# Altium project mb1260.PrjPCB (part 3 of 3)
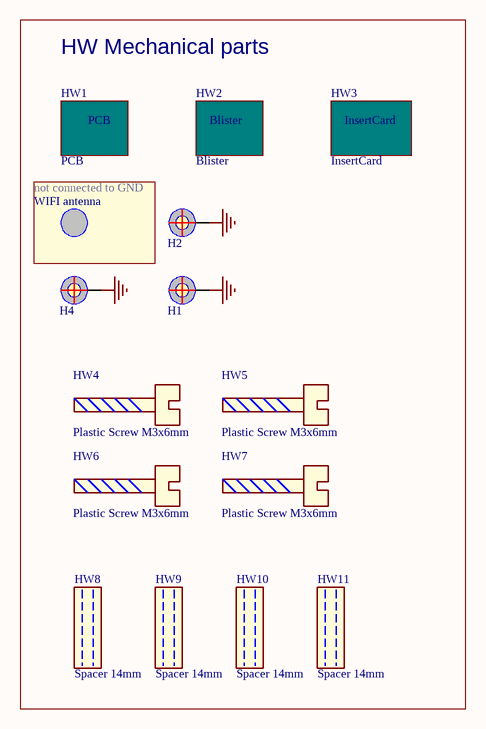
[diagram p13: HW_Mechanical_Parts.SchDoc]

## Nets that join several sheets
1V8: ST_LINK_V2-1 (C57.2 U9.2 U9.4), AUDIO (6 pins)
3V3: ST_LINK_V2-1 (C15.2 C16.2 U4.4 U9.3), AUDIO (11 pins), Peripherals (13 pins), ARDUINO (CN12.2 CN12.4), PSRAM (6 pins), USB_OTG_FS (R73.2 R79.2 R83.2 R84.2), STM32F7 (14 pins), LCD_FRIDA (6 pins), USB_OTG_HS (R80.1 R81.1 R82.2), QSPI (C13.2 R30.2 U5.8 U6.8)
5V: ST_LINK_V2-1 (11 pins), Peripherals (P1.6 P1.15), ARDUINO (CN12.5), USB_OTG_FS (U14.5), LCD_FRIDA (L3.1), USB_OTG_HS (U13.5)
5V_USB_FS: ST_LINK_V2-1 (CN8.7 D3.1), USB_OTG_FS (R99.2)
5V_USB_HS: ST_LINK_V2-1 (CN8.3 D5.1), USB_OTG_HS (6 pins)
E5V: ST_LINK_V2-1 (6 pins), ARDUINO (R58.2)
GND: ST_LINK_V2-1 (55 pins), AUDIO (41 pins), Peripherals (15 pins), ARDUINO (5 pins), PSRAM (5 pins), USB_OTG_FS (13 pins), STM32F7 (70 pins), LCD_FRIDA (12 pins), USB_OTG_HS (13 pins), QSPI (C13.1 U5.4 U6.4), HW_Mechanical_Parts (H1.1 H2.1 H4.1)
VDD: STM32F7 (34 pins), LCD_FRIDA (CN17.25 R68.1 R70.1 SB15.1)
VIN: ST_LINK_V2-1 (C74.2 U11.3), ARDUINO (CN12.8)
VREF+: ARDUINO (C50.2 R53.2), STM32F7 (C59.2 C64.1 R62.1 U8.P1)
ARD_A0: ARDUINO (CN15.1), STM32F7 (U8.P3)
ARD_A1: ARDUINO (CN15.2), STM32F7 (U8.N4)
ARD_A2: ARDUINO (CN15.3), STM32F7 (U8.N5)
ARD_A3: ARDUINO (CN15.4), STM32F7 (U8.L1)
ARD_A4: ARDUINO (SB35.1), STM32F7 (U8.M2)
ARD_A5: ARDUINO (SB37.1), STM32F7 (U8.M3)
ARD_D0: ARDUINO (CN13.1), STM32F7 (U8.R2)
ARD_D1: ARDUINO (CN13.2), STM32F7 (U8.P2)
ARD_D2: ARDUINO (CN13.3), STM32F7 (U8.P5)
ARD_D3: ARDUINO (CN13.4), STM32F7 (U8.B2)
ARD_D4: ARDUINO (CN13.5), STM32F7 (U8.G4)
ARD_D5: ARDUINO (CN13.6), STM32F7 (U8.R5)
ARD_D6: ARDUINO (CN13.7), STM32F7 (U8.B3)
ARD_D7: ARDUINO (CN13.8), STM32F7 (U8.A1)
ARD_D8: ARDUINO (CN11.1), STM32F7 (U8.B1)
ARD_D9: ARDUINO (CN11.2), STM32F7 (U8.M11)
ARD_D10: ARDUINO (CN11.3), STM32F7 (U8.N2)
ARD_D11: ARDUINO (CN11.4), STM32F7 (U8.A6)
ARD_D12: ARDUINO (CN11.5), STM32F7 (U8.A9)
ARD_D13: ARDUINO (CN11.6 SB14.2), STM32F7 (U8.P4)
ARD_D14: ARDUINO (CN11.9 SB36.1), STM32F7 (R59.1 U8.J4)
ARD_D15: ARDUINO (CN11.10 SB38.1), STM32F7 (R60.1 U8.H4)
CTP_INT: STM32F7 (U8.D3), LCD_FRIDA (CN16.2 R21.2)
CTP_RST: STM32F7 (U8.M13), LCD_FRIDA (CN16.7 R18.2)
CTP_SCL: STM32F7 (R52.2 U8.F15), LCD_FRIDA (CN16.5)
CTP_SDA: STM32F7 (R56.1 U8.M12), LCD_FRIDA (CN16.4)
LCD-RS_A0: STM32F7 (R101.2), LCD_FRIDA (CN17.21)
LCD_BL: STM32F7 (U8.L12), LCD_FRIDA (L7.1)
LCD_NE: STM32F7 (U8.C10), LCD_FRIDA (CN17.22 R70.2)
LCD_PSRAM_D0: PSRAM (U10.B6), STM32F7 (U8.M14), LCD_FRIDA (CN17.18)
LCD_PSRAM_D1: PSRAM (U10.C5), STM32F7 (U8.L14), LCD_FRIDA (CN17.17)
LCD_PSRAM_D2: PSRAM (U10.C6), STM32F7 (U8.B12), LCD_FRIDA (CN17.16)
LCD_PSRAM_D3: PSRAM (U10.D5), STM32F7 (U8.C12), LCD_FRIDA (CN17.15)
LCD_PSRAM_D4: PSRAM (U10.E5), STM32F7 (U8.R8), LCD_FRIDA (CN17.14)
LCD_PSRAM_D5: PSRAM (U10.F5), STM32F7 (U8.P8), LCD_FRIDA (CN17.13)
LCD_PSRAM_D6: PSRAM (U10.F6), STM32F7 (U8.P9), LCD_FRIDA (CN17.12)
LCD_PSRAM_D7: PSRAM (U10.G6), STM32F7 (U8.R9), LCD_FRIDA (CN17.11)
LCD_PSRAM_D8: PSRAM (U10.B1), STM32F7 (U8.P10), LCD_FRIDA (CN17.10)
LCD_PSRAM_D9: PSRAM (U10.C1), STM32F7 (U8.R10), LCD_FRIDA (CN17.9)
LCD_PSRAM_D10: PSRAM (U10.C2), STM32F7 (U8.N11), LCD_FRIDA (CN17.8)
LCD_PSRAM_D11: PSRAM (U10.D2), STM32F7 (U8.P11), LCD_FRIDA (CN17.7)
LCD_PSRAM_D12: PSRAM (U10.E2), STM32F7 (U8.R11), LCD_FRIDA (CN17.6)
LCD_PSRAM_D13: PSRAM (U10.F2), STM32F7 (U8.P15), LCD_FRIDA (CN17.5)
LCD_PSRAM_D14: PSRAM (U10.F1), STM32F7 (U8.P14), LCD_FRIDA (CN17.4)
LCD_PSRAM_D15: PSRAM (U10.G1), STM32F7 (U8.N15), LCD_FRIDA (CN17.3)
LCD_PSRAM_NOE: PSRAM (U10.A2), STM32F7 (U8.D10), LCD_FRIDA (CN17.19)
LCD_PSRAM_NWE: PSRAM (R64.1), STM32F7 (U8.C11), LCD_FRIDA (CN17.20)
LCD_RST: STM32F7 (U8.N12), LCD_FRIDA (CN17.23 R68.2)
LCD_TE_INT: STM32F7 (U8.G14), LCD_FRIDA (CN17.2)
NRST: ST_LINK_V2-1 (R28.2 SB10.2), Peripherals (SB34.1), ARDUINO (CN12.3), STM32F7 (C93.2 R57.1 U8.J1)
PMOD_GPIO_0: Peripherals (P2.9), STM32F7 (U8.B8)
PMOD_GPIO_1: Peripherals (P2.10), STM32F7 (U8.F4)
PMOD_INT: Peripherals (P1.11 P2.7), STM32F7 (U8.R13)
PMOD_RESET: Peripherals (P1.12 P2.8), STM32F7 (U8.R6)
PMOD_SEL_0: Peripherals (R102.1 U20.3), STM32F7 (U8.D13)
PMOD_SEL_1: Peripherals (R29.2 U20.10), STM32F7 (U8.E3)
PMOD_SPI2_MISO: Peripherals (U20.6), STM32F7 (U8.C14)
PMOD_SPI2_MOSI: Peripherals (U20.1), STM32F7 (U8.C13)
PMOD_SPI2_NSS: Peripherals (U20.9), STM32F7 (U8.E14)
PMOD_SPI2_SCK: Peripherals (U20.14), STM32F7 (U8.D14)
PMOD_UART7_CTS: Peripherals (U20.7), STM32F7 (U8.L2)
PMOD_UART7_RTS: Peripherals (U20.12), STM32F7 (U8.L3)
PMOD_UART7_RXD: Peripherals (U20.4), STM32F7 (U8.K2)
PMOD_UART7_TXD: Peripherals (U20.15), STM32F7 (U8.K1)
PSRAM_A0: PSRAM (U10.A3), STM32F7 (R101.1 U8.E2)
PSRAM_A1: PSRAM (U10.A4), STM32F7 (U8.H3)
PSRAM_A2: PSRAM (U10.A5), STM32F7 (U8.H2)
PSRAM_A3: PSRAM (U10.B3), STM32F7 (U8.J2)
PSRAM_A4: PSRAM (U10.B4), STM32F7 (U8.J3)
PSRAM_A5: PSRAM (U10.C3), STM32F7 (U8.K3)
PSRAM_A6: PSRAM (U10.C4), STM32F7 (U8.P6)
PSRAM_A7: PSRAM (U10.D4), STM32F7 (U8.N6)
PSRAM_A8: PSRAM (U10.H2), STM32F7 (U8.R7)
PSRAM_A9: PSRAM (U10.H3), STM32F7 (U8.P7)
PSRAM_A10: PSRAM (U10.H4), STM32F7 (U8.N7)
PSRAM_A11: PSRAM (U10.H5), STM32F7 (U8.M7)
PSRAM_A12: PSRAM (U10.G3), STM32F7 (U8.L15)
PSRAM_A13: PSRAM (U10.G4), STM32F7 (U8.K15)
PSRAM_A14: PSRAM (U10.F3), STM32F7 (U8.K14)
PSRAM_A15: PSRAM (U10.F4), STM32F7 (U8.K13)
PSRAM_A16: PSRAM (U10.E4), STM32F7 (U8.N14)
PSRAM_A17: PSRAM (U10.D3), STM32F7 (U8.N13)
PSRAM_NBL0: PSRAM (U10.A1), STM32F7 (U8.A4)
PSRAM_NBL1: PSRAM (U10.B2), STM32F7 (U8.A3)
PSRAM_NE1: PSRAM (R65.1), STM32F7 (U8.A11)
QSPI_CLK: STM32F7 (U8.M6), QSPI (U5.6 U6.6)
QSPI_D0: STM32F7 (U8.F14), QSPI (U5.5 U6.5)
QSPI_D1: STM32F7 (U8.B14), QSPI (U5.2 U6.2)
QSPI_D2: STM32F7 (U8.A2), QSPI (U5.3 U6.3)
QSPI_D3: STM32F7 (U8.M15), QSPI (U5.7 U6.7)
QSPI_NCS: STM32F7 (U8.B6), QSPI (R30.1 U5.1 U6.1)
SAI2_FS_A: AUDIO (U7.E3), STM32F7 (TP11.1 U8.C2)
SAI2_I2C1_SCL: AUDIO (R39.1), STM32F7 (R44.2 U8.A5)
SAI2_I2C1_SDA: AUDIO (R35.1), STM32F7 (R42.2 U8.B4)
SAI2_INT: AUDIO (U7.G3), STM32F7 (U8.B7)
SAI2_MCLK_A: AUDIO (U7.D3), STM32F7 (TP6.1 U8.D4)
SAI2_SCK_A: AUDIO (U7.G1), STM32F7 (TP7.1 U8.C4)
SAI2_SD_A: AUDIO (U7.E4), STM32F7 (TP12.1 U8.C3)
SAI2_SD_B: AUDIO (U7.F2), STM32F7 (TP4.1 U8.B10)
STMOD+_SPI2_MISOs: Peripherals (P1.9), STM32F7 (U8.M4)
STMOD+_SPI2_MOSIs: Peripherals (P1.8), STM32F7 (U8.M5)
STMOD+_TIM2_CH1: Peripherals (P1.19), STM32F7 (U8.A13)
STMOD+_UART4_RXD: Peripherals (P1.18), STM32F7 (U8.E13)
STMOD+_UART4_RXD_s: Peripherals (P1.20), STM32F7 (U8.B13)
STMOD+_UART4_TXD: Peripherals (P1.17), STM32F7 (U8.E12)
SYS_B_USER: Peripherals (SB33.1), STM32F7 (U8.N3)
SYS_LD_USER1: Peripherals (R47.1), STM32F7 (U8.R3)
SYS_LD_USER2: Peripherals (R48.1), STM32F7 (U8.R4)
SYS_STLINK_JTCK: ST_LINK_V2-1 (R38.2 SB12.2), STM32F7 (U8.A14)
SYS_STLINK_JTDO-SWO: ST_LINK_V2-1 (R40.2 SB13.2), STM32F7 (U8.A10)
SYS_STLINK_JTMS: ST_LINK_V2-1 (R32.2 SB11.2), STM32F7 (U8.A15)
USB_OTGFS_ID: USB_OTG_FS (CN18.4 U23.1), STM32F7 (U8.D15)
USB_OTGFS_N: USB_OTG_FS (U22.1), STM32F7 (U8.C15)
USB_OTGFS_OVCR: USB_OTG_FS (LD10.2 R79.1 U14.3), STM32F7 (U8.R12)
USB_OTGFS_P: USB_OTG_FS (U22.3), STM32F7 (U8.B15)
USB_OTGFS_PPWR_EN: USB_OTG_FS (R72.1), STM32F7 (U8.H14)
USB_OTGFS_VBUS: USB_OTG_FS (6 pins), STM32F7 (U8.E15)
USB_OTGHS_ID: STM32F7 (U8.P12), USB_OTG_HS (CN19.4 U15.4)
USB_OTGHS_N: STM32F7 (U8.R14), USB_OTG_HS (U15.7)
USB_OTGHS_OVCR: STM32F7 (U8.L13), USB_OTG_HS (R78.2)
USB_OTGHS_P: STM32F7 (U8.R15), USB_OTG_HS (U15.6)
USB_OTGHS_PPWR_EN: STM32F7 (U8.K12), USB_OTG_HS (R16.2 U13.4)
USB_OTGHS_VBUS: STM32F7 (U8.P13), USB_OTG_HS (R98.1)
VCP_RX: ST_LINK_V2-1 (CN6.2 SB8.1), STM32F7 (U8.G15)
VCP_TX: ST_LINK_V2-1 (CN6.1 SB9.1), STM32F7 (U8.H15)
WIFI_CH_PD: Peripherals (CN14.6 R95.2), STM32F7 (U8.D11)
WIFI_GPIO_0: Peripherals (CN14.3 R93.2), STM32F7 (U8.A8)
WIFI_GPIO_2: Peripherals (CN14.5 R96.2), STM32F7 (U8.B11)
WIFI_RST: Peripherals (CN14.4 R94.2), STM32F7 (U8.A7)
WIFI_RX: Peripherals (R92.1), STM32F7 (U8.A12)
WIFI_TX: Peripherals (R97.2), STM32F7 (U8.D12)

## Assembly variants
F723E: not fitted C50 C87 CN2 CN3 CN6 CN7 CN9 CN10 JP1 L2 R5 R19 R24 R37 R41 R43 R57 R71 R91 SB2 SB3 SB5 SB6 SB16 SB36 SB38 TP1 TP2 TP3 TP4 TP5 TP6 TP7 TP8 TP11 TP12 TP13 TP14 TP15 U6